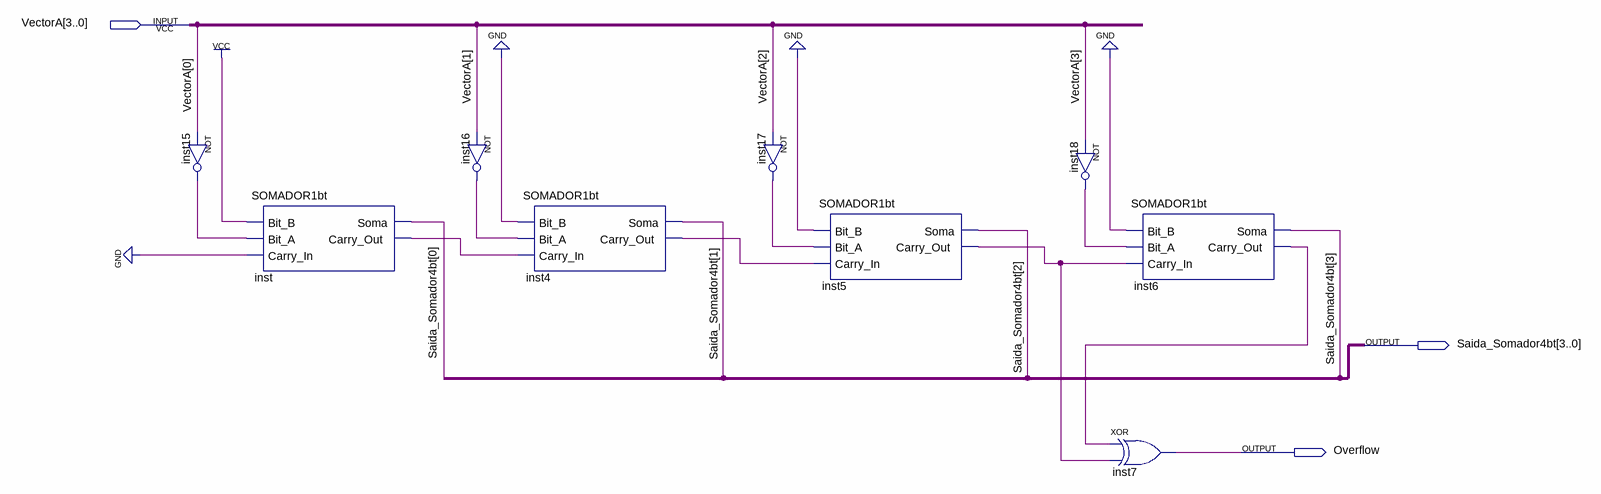
[diagram p0: schematic sheet]
// Quartus schematic COMPLEMENTOa2.bdf as structural Verilog: 9 symbols, 3 pins
module COMPLEMENTOa2 (
  input  [3:0] VectorA,
  output [3:0] Saida_Somador4bt,
  output Overflow
);

  wire inst4_carry_out, inst5_carry_out, inst6_carry_out, inst15_out, inst16_out, inst17_out, inst18_out,
       inst_carry_out;

  not inst15 (inst15_out, VectorA[0]);
  SOMADOR1bt inst (
    .Bit_B(1'b1), .Bit_A(inst15_out), .Carry_In(1'b0), .Soma(Saida_Somador4bt[0]), .Carry_Out(inst_carry_out));
  not inst16 (inst16_out, VectorA[1]);
  SOMADOR1bt inst4 (
    .Bit_B(1'b0), .Bit_A(inst16_out), .Carry_In(inst_carry_out), .Soma(Saida_Somador4bt[1]),
    .Carry_Out(inst4_carry_out));
  not inst17 (inst17_out, VectorA[2]);
  SOMADOR1bt inst5 (
    .Bit_B(1'b0), .Bit_A(inst17_out), .Carry_In(inst4_carry_out), .Soma(Saida_Somador4bt[2]),
    .Carry_Out(inst5_carry_out));
  not inst18 (inst18_out, VectorA[3]);
  SOMADOR1bt inst6 (
    .Bit_B(1'b0), .Bit_A(inst18_out), .Carry_In(inst5_carry_out), .Soma(Saida_Somador4bt[3]),
    .Carry_Out(inst6_carry_out));
  xor inst7 (Overflow, inst6_carry_out, inst5_carry_out);
endmodule
